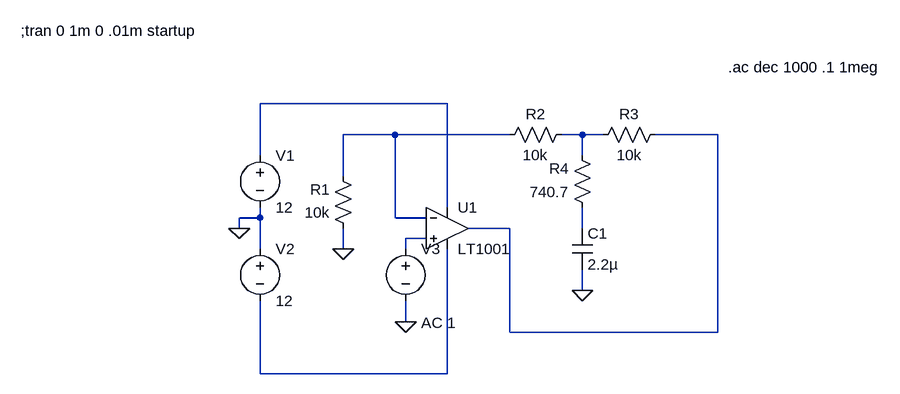
[diagram p0: schematic control.asc]
control.asc, the LTspice schematic file:
Version 4
SHEET 1 1028 680
WIRE 208 0 -80 0
WIRE 128 48 48 48
WIRE 304 48 128 48
WIRE 416 48 384 48
WIRE 448 48 416 48
WIRE 624 48 528 48
WIRE -80 80 -80 0
WIRE 416 80 416 48
WIRE 48 112 48 48
WIRE 208 160 208 0
WIRE -80 176 -80 160
WIRE -80 176 -112 176
WIRE 128 176 128 48
WIRE 176 176 128 176
WIRE -112 192 -112 176
WIRE 304 192 240 192
WIRE 416 192 416 160
WIRE 176 208 144 208
WIRE -80 224 -80 176
WIRE 48 224 48 192
WIRE 144 224 144 208
WIRE 416 288 416 256
WIRE 144 336 144 304
WIRE 304 352 304 192
WIRE 624 352 624 48
WIRE 624 352 304 352
WIRE -80 416 -80 304
WIRE 208 416 208 224
WIRE 208 416 -80 416
FLAG -112 192 0
FLAG 144 336 0
FLAG 416 288 0
FLAG 48 224 0
SYMBOL Opamps\\LT1001 208 128 R0
SYMATTR InstName U1
SYMBOL voltage -80 64 R0
WINDOW 123 0 0 Left 2
WINDOW 39 0 0 Left 2
SYMATTR InstName V1
SYMATTR Value 12
SYMBOL voltage -80 208 R0
WINDOW 123 0 0 Left 2
WINDOW 39 0 0 Left 2
SYMATTR InstName V2
SYMATTR Value 12
SYMBOL res 64 208 R180
WINDOW 0 36 76 Left 2
WINDOW 3 36 40 Left 2
SYMATTR InstName R1
SYMATTR Value 10k
SYMBOL res 400 32 R90
WINDOW 0 0 56 VBottom 2
WINDOW 3 32 56 VTop 2
SYMATTR InstName R2
SYMATTR Value 10k
SYMBOL res 544 32 R90
WINDOW 0 0 56 VBottom 2
WINDOW 3 32 56 VTop 2
SYMATTR InstName R3
SYMATTR Value 10k
SYMBOL res 432 176 R180
WINDOW 0 36 76 Left 2
WINDOW 3 36 40 Left 2
SYMATTR InstName R4
SYMATTR Value 740.7
SYMBOL cap 400 192 R0
SYMATTR InstName C1
SYMATTR Value 2.2µ
SYMBOL voltage 144 208 R0
WINDOW 123 24 130 Left 2
WINDOW 39 0 0 Left 2
SYMATTR Value2 AC 1
SYMATTR InstName V3
SYMATTR Value ""
TEXT 640 -56 Left 2 !.ac dec 1000 .1 1meg
TEXT -448 -112 Left 2 !;tran 0 1m 0 .01m startup

The netlist it stands for:
* control.asc
XU1 N006 N002 N001 N007 N004 LT1001  ; pins In+ In- V+ V- OUT
V1 N001 0 12
V2 0 N007 12
R1 0 N002 10k
R2 N003 N002 10k
R3 N004 N003 10k
R4 N005 N003 740.7
C1 N005 0 2.2µ
V3 N006 0 AC 1
.ac dec 1000 .1 1meg
;tran 0 1m 0 .01m startup
.lib LTC.lib
.backanno
.end